# Altium schematic sheet AdaptadorBateria.SchDoc
size A4; SheetNumber: 2; SheetTotal: 3
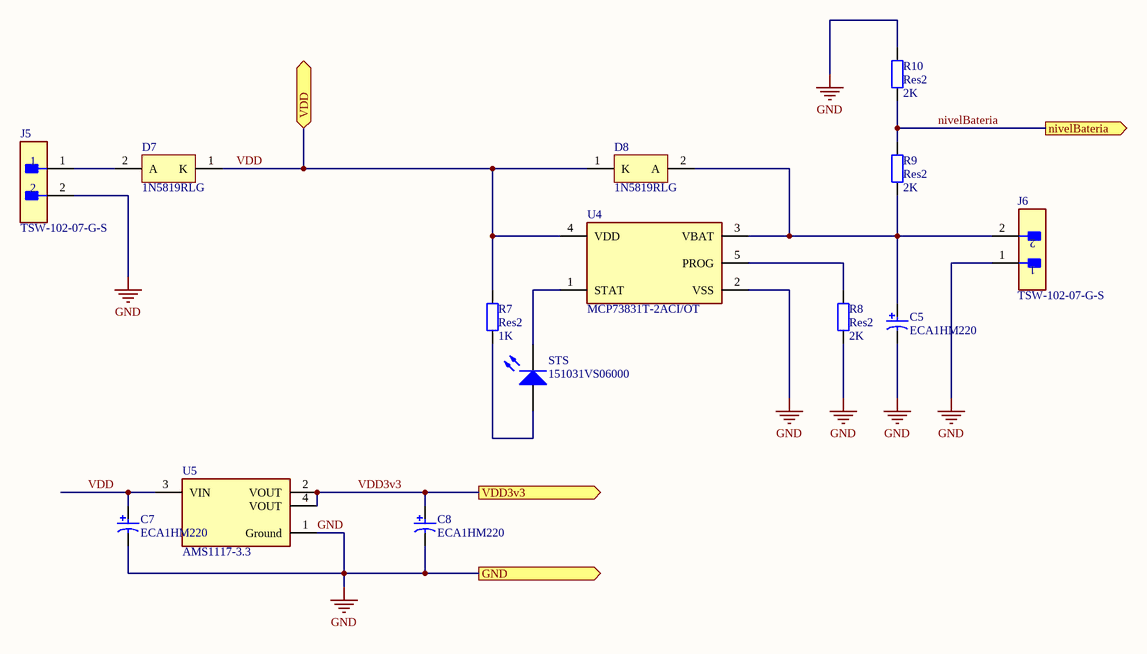
[diagram p0: AdaptadorBateria.SchDoc]

## Parts
C5  ECA1HM220  [CAPPR55-200-1100X500X1200]
C7  ECA1HM220  [CAPPR55-200-1100X500X1200]
C8  ECA1HM220  [CAPPR55-200-1100X500X1200]
D7  1N5819RLG  [ONSC-AXIAL_LEAD-2-59-10_P]
D8  1N5819RLG  [ONSC-AXIAL_LEAD-2-59-10_P]
J5  TSW-102-07-G-S  [FP-TSW-102-07-G-S-MFG]
J6  TSW-102-07-G-S  [FP-TSW-102-07-G-S-MFG]
R7  Res2  value 1K  [AXIAL-0.4]
R8  Res2  value 2K  [AXIAL-0.4]
R9  Res2  value 2K  [AXIAL-0.4]
R10  Res2  value 2K  [AXIAL-0.4]
STS  151031VS06000  [Type 3mm]
U4  MCP73831T-2ACI/OT  [FP-C04-091-OT-IPC_B]
U5  AMS1117-3.3  [FP-AMS1117-IPC_C]

## Ports
GND (out), nivelBateria (out), VDD3v3 (out), VDD (bidir)

## Nets
GND: C5.2 C7.2 C8.2 J5.2 J6.1 R8.1 R10.2 U4.2(VSS) U5.1(Ground) ; port GND
nivelBateria: R9.2 R10.1 ; port nivelBateria
VDD: C7.1 D7.1(K) D8.1(K) R7.2 U4.4(VDD) U5.3(VIN) ; port VDD
VDD3v3: C8.1 U5.2(VOUT) U5.4(VOUT) ; port VDD3v3
NetC5_1: C5.1 D8.2(A) J6.2 R9.1 U4.3(VBAT)
NetD7_2: D7.2(A) J5.1
NetR7_1: R7.1 STS.2(A)
NetR8_2: R8.2 U4.5(PROG)
NetSTS_1: STS.1(K) U4.1(STAT)

## Library data of the parts
C5 C7 C8 = CMP-1665-00036-2: Aluminum Electrolytic Capacitor, 22 uF, +/- 20%, 50 V, -40 to 85 degC, 2-Pin THD, RoHS, Bulk; Manufacturer: Panasonic; Ripple Current: 100mA; Life (Hours): 2000Hour; Voltage: 50V; Dissipation Factor: 0.12%; Leakage Current: 3uA; Lead/Base Style: Straight; Capacitance: 22uF; Lead Diameter: 0.5mm; Max Operating Temperature: 85degC; Height: 11mm; Package Reference: CAPPR55-200-1100X500X1200; Radiation Hardening: No; RoHSCompliant: true; Termination: Radial; Case/Package: Radial; REACH SVHC: NoSVHC; Height - Seated (Max): 0.472inch; Min Operating Temperature: -40degC; Packaging: Bulk; Manufacturer URL: http://www.panasonic.com/; Length: 11mm; Tolerance: 20%; Voltage Rating: 50V; Voltage Rating (DC): 50V; Datasheet URL: https://industrial.panasonic.com/cdbs/www-data/pdf/RDF0000/ABA0000C1218.pdf; Lead Pitch: 2mm; Ripple Current (AC): 100mA; Package Description: 2-Pin Radial Lead, Dia 5 mm, Height 12 mm; Diameter: 5mm; Datasheet Version: Rev. 05, 10/2016; Package Quantity: 200; Mount: ThroughHole
D7 D8 = CMP-1055-00037-1: Rectifier, 2-Pin Axial_Lead, Pb-Free, Tape and Reel; Manufacturer: On Semiconductor; IFSM Max (A): 25; Configuration: Single; ComponentLink1Description: Manufacturer URL; PackageReference: AXIAL_LEAD-2-59-10; RoHS: TRUE; PackageVersion: Rev. U, 02/2005; Mounting Technology: Through Hole; ComponentLink3URL: http://www.onsemi.cn/pub_link/Collateral/59-10.PDF; ComponentLink3Description: Package Specification; PackageDescription: 2-Pin, Axial Lead, Diameter 2.35 mm; ComponentLink2Description: Datasheet; ComponentLink1URL: http://www.onsemi.com/; Packing: Tape and Reel; DatasheetVersion: Rev. 10; ComponentLink2URL: http://www.onsemi.cn/pub_link/Collateral/1N5817-D.PDF; PartNumber: 1N5819RLG
J5 J6 = CMP-02766-000084-1: CONN HEADER VERT 2POS 2.54MM; Manufacturer: Samtec; Number Of Contacts: 2; Voltage Rating: 550V; Conn Orientation: Straight; Current Rating: 6.3A; Conn Gender: Male; Package: TSW-102-07-G-S; Digikey Description: CONN HEADER VERT 2POS 2.54MM; ComponentLink2URL: http://suddendocs.samtec.com/catalog_english/tsw_th.pdf; Height: 8.71mm; Temperature: -55°C to +125°C; Device Class L2: Headers and Wire Housings; ComponentLink2Description: Datasheet; Device Class L3: unset; Contact Material: Gold,Nickel; Temperature Range Low: -55°C; Temperature Range High: +125°C; RoHS: TRUE; Device Class L1: Connectors; Mouser Description: Conn Unshrouded Header HDR 2 POS 2.54mm Solder ST Thru-Hole Automotive Bulk; Number Of Rows: 1; Category: Conn; Pitch: 2.54mm; Lead Free: Yes; Automotive: No; Manufacturer Part Number: TSW-102-07-G-S; Footprint Url: http://suddendocs.samtec.com/prints/tsw-xxx-xx-x-x-xx-xxx-footprint.pdf; Octopart: https://octopart.com/tsw-102-07-g-s-samtec-272197
R7-R10 = Res2: Resistor; Published: 8-Jun-2000; LatestRevisionDate: 17-Jul-2002; LatestRevisionNote: Re-released for DXP Platform.; PackageReference: AXIAL-0.4; Publisher: Altium Limited; PackageDescription: Axial Device, Thru-Hole; 2 Leads; 0.4 in Pin Spacing
STS = CMP-1488-00004-1: THT LED round mono-color color lens, WL-TMRC , Bright Green; Manufacturer: Wuerth Elektronik; ComponentLink2Description: Datasheet; ComponentLink1URL: http://www.we-online.com; PartNumber: 151031VS06000; ComponentLink2URL: http://katalog.we-online.de/pbs/datasheet/7448042001.pdfhttp://katalog.we-online.de/pbs/datasheet/7448042001.pdfhttp://katalog.we-online.de/pbs/datasheet/7448042001.pdfhttp://katalog.we-online.de/pbs/datasheet/151031VS06000.pdf; ComponentLink1Description: Manufacturer URL; Emitting color: Bright Green; PackageReference: Type 3mm
U4 = CMP-0133-00143-2: IC CONTROLLR LI-ION 4.2V SOT23-5; Max Power Dissipation: 1.54W; Output Current: 500mA; Max Output Voltage: 4.5V; Number of Outputs: 1; Min Output Voltage: 4.168V; Min Supply Voltage: 3.75V; Max Input Voltage: 6V; Voltage Rating: 4.534V; Drain to Source Resistance: 350mR; Max Operating Temperature: 85°C; Length: 0.122inch; Number of Pins: 5; REACH SVHC: No SVHC; Radiation Hardening: No; Min Operating Temperature: -40°C; Weight: 0.00709oz; Contact Plating: Tin; Termination: SMD/SMT; Case/Package: SOT-23; Mount: Surface Mount; Width: 0.071inch; Packaging: Tape and Reel; Number of Cells: 1; Max Charge Current: 500mA; Height: 0.051inch; Number of Channels: 1; Output Voltage: 4.2V; Max Supply Voltage: 6V; Lead Free: Lead Free
U5 = CMP-209535-000001-1: LDO Voltage Regulators 1A, 3.3V; Manufacturer: Advanced Monolithic Systems; Dropout Voltage: 1.1V; Output Type: Fixed; Nominal Supply Current: 5mA; Max Power Dissipation: 1.2W; Max Supply Voltage: 15V; Number Of Outputs: 1; Standoff Height: 0.64mm; Max Junction Temp: +125°C; Height: 1.8mm; Package: AMS1117; Device Class L2: Power Management ICs; ComponentLink2Description: Datasheet; ComponentLink2URL: http://www.advanced-monolithic.com/pdf/ds1117.pdf; Category: IC; RoHS: TRUE; Automotive: No; Device Class L1: Integrated Circuits (ICs); Output Current: 1A; Device Class L3: Voltage Regulators - Linear; Temperature: -40°C to +125°C; Output Voltage: 3.3V; Manufacturer Part Number: AMS1117-3.3; Temperature Range Low: -40°C; Octopart: https://octopart.com/ams1117-3.3-advanced+monolithic+systems-25899300; Lead Free: Yes; Ipc Land Pattern Name: SOT229P700X180-4; Temperature Range High: +125°C